# EAGLE design game_board_v02 (EAGLE 6.1)
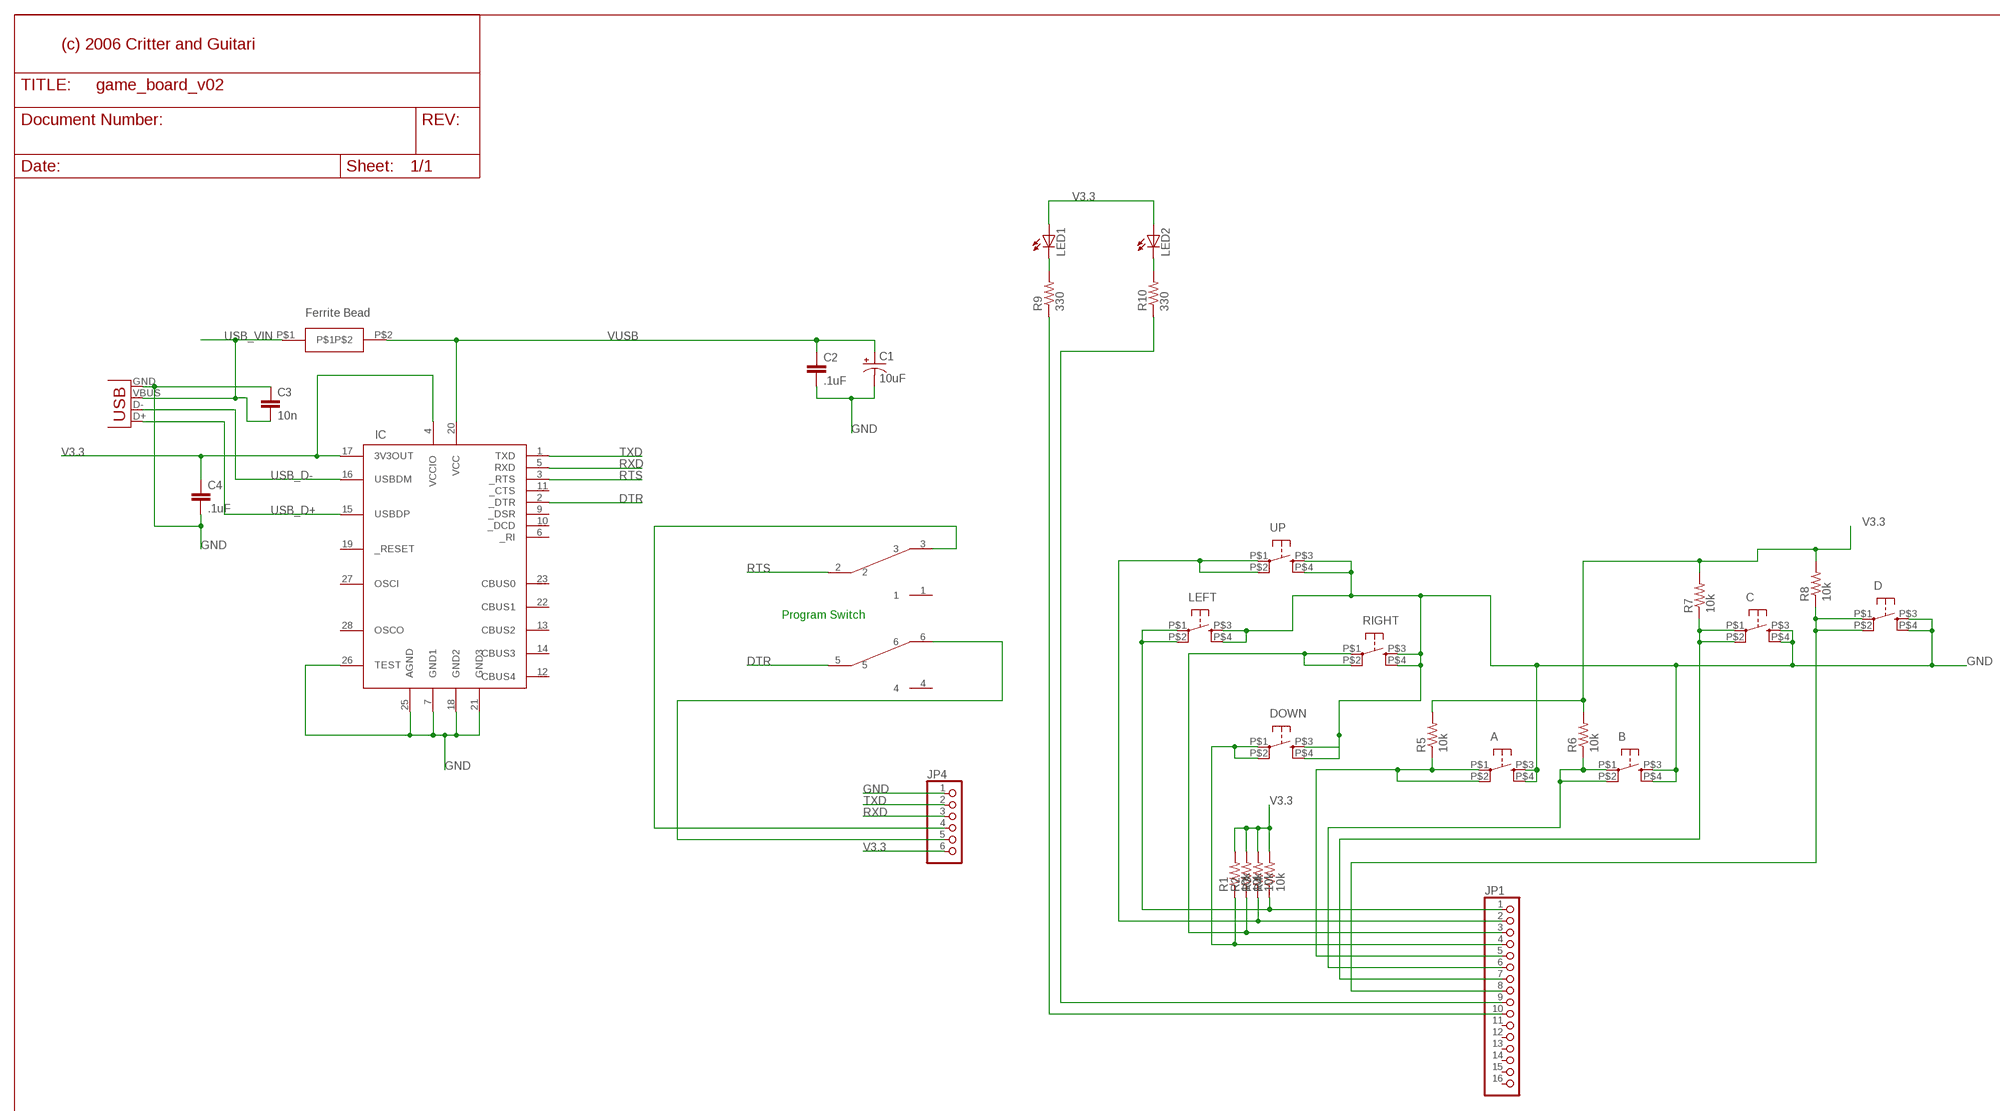
[diagram p0: schematic, sheet 1]

## Parts
A  TAC_SWITCHKSA_SEALED_TAC_SWITCH  [KSA_SEALED_TAC_SWITCH]
B  TAC_SWITCHKSA_SEALED_TAC_SWITCH  [KSA_SEALED_TAC_SWITCH]
C  TAC_SWITCHKSA_SEALED_TAC_SWITCH  [KSA_SEALED_TAC_SWITCH]
C1  10uF  CAP_POL1206  [CPOL_1206]
C2  .1uF  CAP0603  [C0603]
C3  10n  CAP0603  [C0603]
C4  .1uF  CAP0603  [C0603]
D  TAC_SWITCHKSA_SEALED_TAC_SWITCH  [KSA_SEALED_TAC_SWITCH]
DOWN  TAC_SWITCHKSA_SEALED_TAC_SWITCH  [KSA_SEALED_TAC_SWITCH]
IC  FT232RL  [SSOP28DB]
JP1  PINHD-1X16  [1X16]
JP4  PINHD-1X6  [1X06]
LED1  LED1206  [CHIPLED_1206]
LED2  LED1206  [CHIPLED_1206]
LEFT  TAC_SWITCHKSA_SEALED_TAC_SWITCH  [KSA_SEALED_TAC_SWITCH]
R1  10k  RES0603  [R0603]
R2  10k  RES0603  [R0603]
R3  10k  RES0603  [R0603]
R4  10k  RES0603  [R0603]
R5  10k  RES0603  [R0603]
R6  10k  RES0603  [R0603]
R7  10k  RES0603  [R0603]
R8  10k  RES0603  [R0603]
R9  330  RES0603  [R0603]
R10  330  RES0603  [R0603]
RIGHT  TAC_SWITCHKSA_SEALED_TAC_SWITCH  [KSA_SEALED_TAC_SWITCH]
U$1  FERRITE_BEAD  [FERRITE_BEAD]
U$2  SWITCH_DPDT  [SWITCH_DPDT_SMT]
UP  TAC_SWITCHKSA_SEALED_TAC_SWITCH  [KSA_SEALED_TAC_SWITCH]
X2  USB-B-H  [USB-B-H]

## Nets
DTR: IC.2(_DTR) U$2.5
GND [power]: A.P$3(S) A.P$4(S1) B.P$3(S) B.P$4(S1) C1.C(-) C2.2 C3.1 C4.2 C.P$3(S) C.P$4(S1) D.P$3(S) D.P$4(S1) DOWN.P$3(S) DOWN.P$4(S1) IC.7(GND1) IC.18(GND2) IC.21(GND3) IC.25(AGND) IC.26(TEST) JP4.1 LEFT.P$3(S) LEFT.P$4(S1) RIGHT.P$3(S) RIGHT.P$4(S1) UP.P$3(S) UP.P$4(S1) X2.GND
N$1: JP4.4 U$2.3
N$2: JP4.5 U$2.6
N$3: JP1.1 LEFT.P$1(P) LEFT.P$2(P1) R4.1
N$4: JP1.2 R3.1 UP.P$1(P) UP.P$2(P1)
N$5: JP1.3 R2.1 RIGHT.P$1(P) RIGHT.P$2(P1)
N$6: DOWN.P$1(P) DOWN.P$2(P1) JP1.4 R1.1
N$7: A.P$1(P) A.P$2(P1) JP1.5 R5.1
N$8: B.P$1(P) B.P$2(P1) JP1.6 R6.1
N$9: C.P$1(P) C.P$2(P1) JP1.7 R7.1
N$10: D.P$1(P) D.P$2(P1) JP1.8 R8.1
N$11: LED1.C R9.2
N$12: LED2.C R10.2
N$13: JP1.10 R9.1
N$14: JP1.9 R10.1
RTS: IC.3(_RTS) U$2.2
RXD: IC.5(RXD) JP4.3
TXD: IC.1(TXD) JP4.2
USB_D+: IC.15(USBDP) X2.D+
USB_D-: IC.16(USBDM) X2.D-
USB_VIN [power]: C3.2 U$1.P$1 X2.VBUS
V3.3 [power]: C4.1 IC.4(VCCIO) IC.17(3V3OUT) JP4.6 LED1.A LED2.A R1.2 R2.2 R3.2 R4.2 R5.2 R6.2 R7.2 R8.2
VUSB [power]: C1.A(+) C2.1 IC.20(VCC) U$1.P$2
Unconnected: IC.6(_RI) IC.9(_DSR) IC.10(_DCD) IC.11(_CTS) IC.12(CBUS4) IC.13(CBUS2) IC.14(CBUS3) IC.19(_RESET) IC.22(CBUS1) IC.23(CBUS0) IC.27(OSCI) IC.28(OSCO) JP1.11 JP1.12 JP1.13 JP1.14 JP1.15 JP1.16 U$2.1 U$2.4

## Notes on the sheet
- (c) 2006 Critter and Guitari
- Ferrite Bead
- Program Switch

## Library data of the parts
A B C D DOWN LEFT RIGHT UP = SparkFun:TAC_SWITCH: OMRON SWITCH
C1 = SparkFun:CAP_POL
C2-C4 = SparkFun:CAP: CAPACITOR
IC = ftdichip:FT232RL: USB UART 4th Generation USB UART (USB <-> Serial) Controller
JP1 = pinhead:PINHD-1X16: PIN HEADER
JP4 = pinhead:PINHD-1X6: PIN HEADER
LED1 LED2 = SparkFun:LED
R1-R10 = SparkFun:RES: RESISTOR
U$1 = SparkFun:FERRITE_BEAD
U$2 = SparkFun:SWITCH_DPDT
X2 = con-usb:USB: USB Connectors

## Net classes
0 default: width 0.254 mm
1 power: width 0.305 mm

## Board
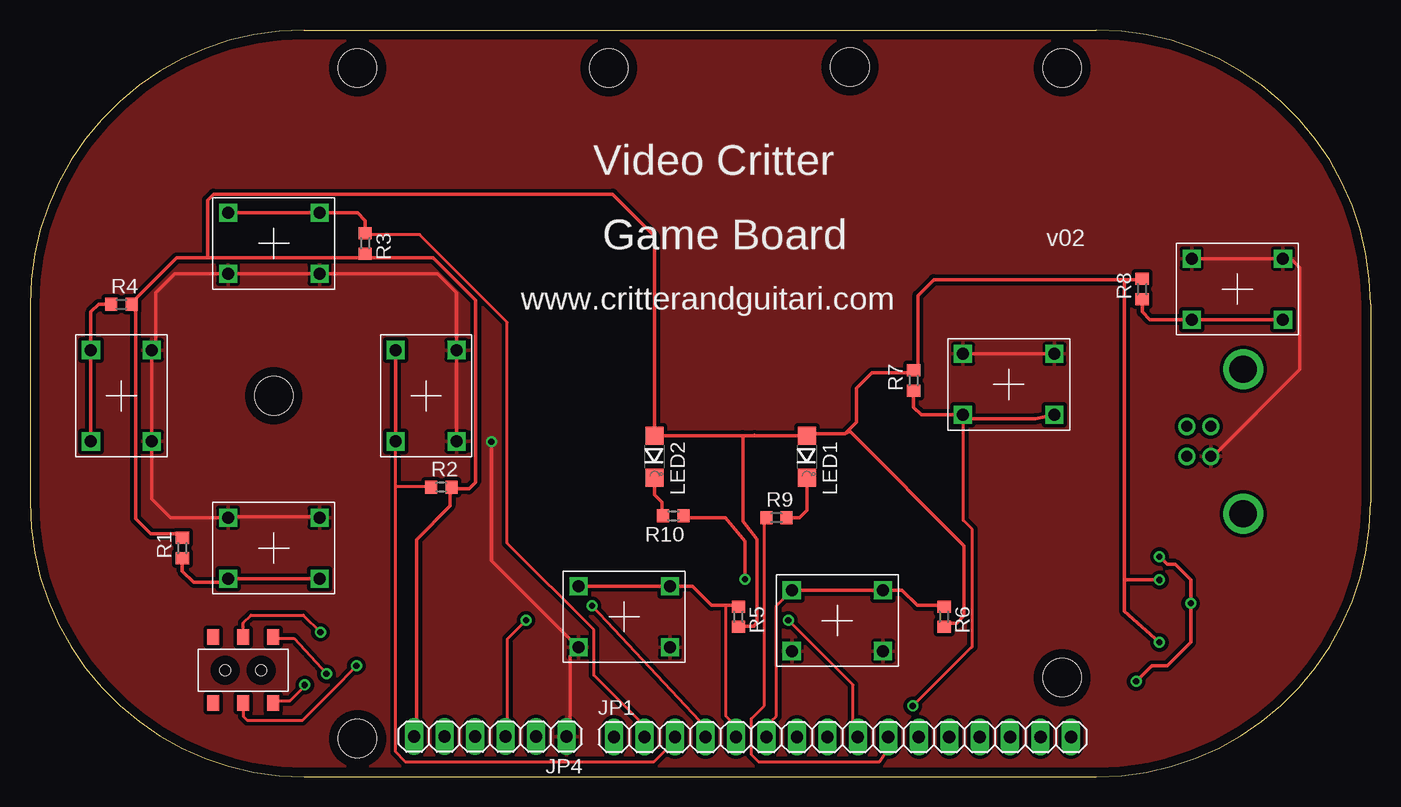
[diagram p1: board, top side]
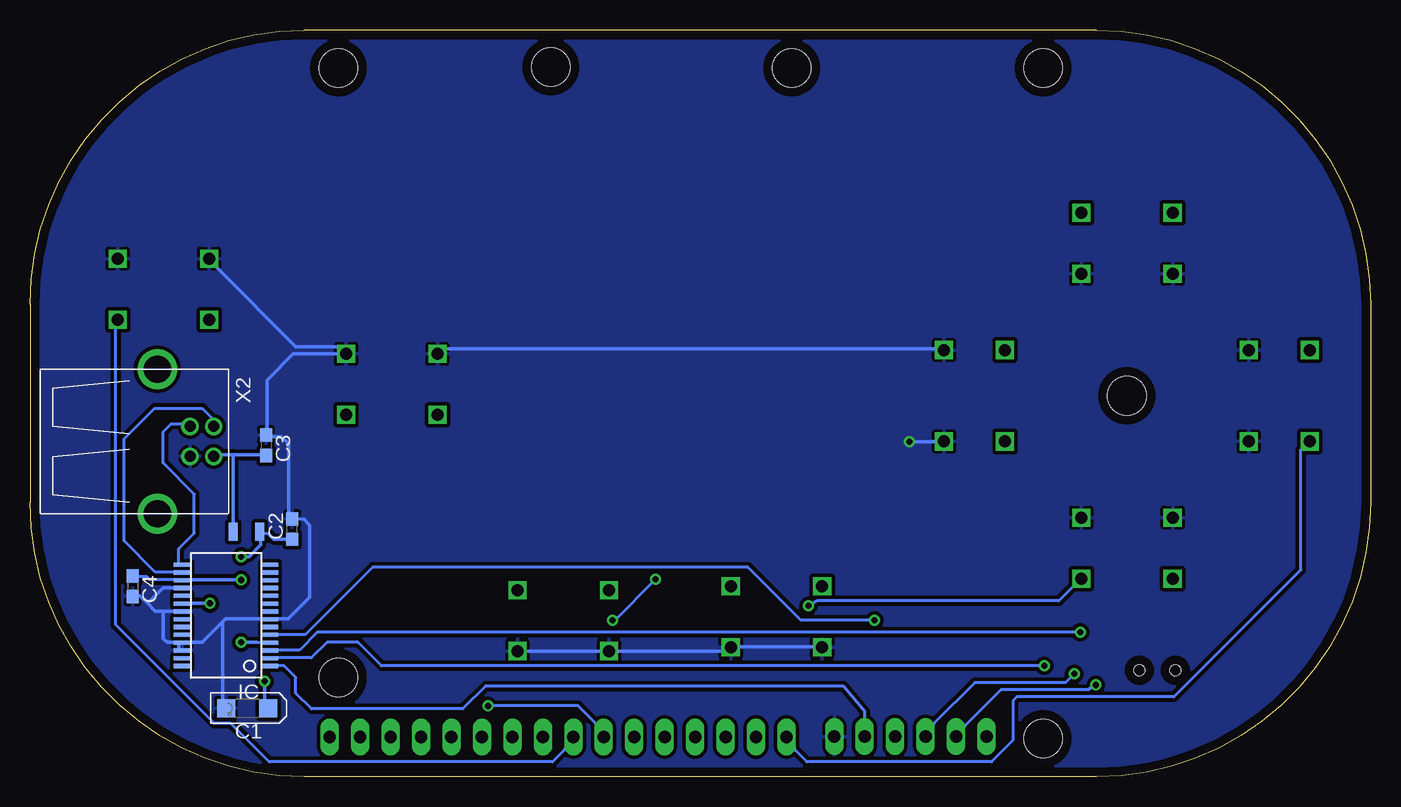
[diagram p2: board, bottom side, seen from below]

Size 111.76 x 62.23 mm. Coordinates in mm from the lower left corner, seen from the top.
Outline: 22.86,62.23 arc90 0,39.37 0,22.86 arc90 22.86,0 88.9,0 arc90 111.76,22.86 111.76,39.37 arc90 88.9,62.23 22.86,62.23
Copper layers (1*16): Top 0.035mm / dielectric 1.5mm / Bottom 0.035mm
Design rules: minimum track width 10mil, minimum drill 20mil, track to track 10mil, track to pad 10mil, pad to pad 10mil, via to via 10mil, smd to smd 10mil, copper to edge 30mil, drill to drill 8mil, minimum pad ring 10mil, minimum via ring 8mil, stop-mask expansion 4mil, vias tented up to drill 0mil, thermal gap 10mil
Holes 3.2 mm at 86.04,59.05 48.26,59.05 68.35,59.16 27.3,59.05 27.3,3.18 86.04,8.26 20.32,31.75

### Footprints (pad centres in the part's own frame; a part is rotated, then mirrored left to right if it is on the bottom)
KSA_SEALED_TAC_SWITCH = drill 1 square: P$1 -3.81,2.54; P$2 3.81,2.54; P$3 -3.81,-2.54; P$4 3.81,-2.54
CPOL_1206 = smd 1.5 x 1.5: A 0,-1.75; C 0,1.75
C0603 = smd 1.1 x 1: 1 -0.85,0; 2 0.85,0
SSOP28DB = smd 0.348 x 1.397: 1 -4.225,-3.656; 2 -3.575,-3.656; 3 -2.925,-3.656; 4 -2.275,-3.656; 5 -1.625,-3.656; 6 -0.975,-3.656; 7 -0.325,-3.656; 8 0.325,-3.656; 9 0.975,-3.656; 10 1.625,-3.656; 11 2.275,-3.656; 12 2.925,-3.656; 13 3.575,-3.656; 14 4.225,-3.656; 15 4.225,3.656; 16 3.575,3.656; 17 2.925,3.656; 18 2.275,3.656; 19 1.625,3.656; 20 0.975,3.656; 21 0.325,3.656; 22 -0.325,3.656; 23 -0.975,3.656; 24 -1.625,3.656; 25 -2.275,3.656; 26 -2.925,3.656; 27 -3.575,3.656; 28 -4.225,3.656
1X16 = drill 1.016 long: 1 -19.05,0; 2 -16.51,0; 3 -13.97,0; 4 -11.43,0; 5 -8.89,0; 6 -6.35,0; 7 -3.81,0; 8 -1.27,0; 9 1.27,0; 10 3.81,0; 11 6.35,0; 12 8.89,0; 13 11.43,0; 14 13.97,0; 15 16.51,0; 16 19.05,0
1X06 = drill 1.016 long: 1 -6.35,0; 2 -3.81,0; 3 -1.27,0; 4 1.27,0; 5 3.81,0; 6 6.35,0
CHIPLED_1206 = smd 1.5 x 1.5: A 0,-1.75; C 0,1.75
R0603 = smd 1 x 1.1: 1 -0.85,0; 2 0.85,0
FERRITE_BEAD = smd 0.75 x 1.5: P$1 -1.1,0; P$2 1.1,0
SWITCH_DPDT_SMT = smd 1 x 1.3: 1 -2.5,2.75; 2 0,2.75; 3 2.5,2.75; 4 -2.5,-2.75; 5 0,-2.75; 6 2.5,-2.75 | hole 0.9: -1.5,0; 1.5,0
USB-B-H = drill 0.914: D+ 0,1.25; D- 1.981,1.25; GND 0,-1.25; VBUS 1.981,-1.25 | drill 2.286: P$1 -2.718,-6.02; P$2 -2.718,6.02

### Placement (x,y rotation side)
A  49.53,13.33 0 top
B  67.31,13.02 0 top
C  81.6,32.7 180 top
C1  93.66,5.71 90 bottom
C2  89.89,20.64 90 bottom
C3  92.08,27.62 270 bottom
C4  103.2,15.88 270 bottom
D  100.65,40.64 180 top
DOWN  20.32,19.05 180 top
IC  95.41,13.45 90 bottom
JP1  67.74,3.31 0 top
JP4  38.37,3.35 180 top
LED1  64.77,26.67 180 top
LED2  52.07,26.67 180 top
LEFT  7.62,31.75 90 top
R1  12.7,19.05 90 top
R2  34.29,24.13 0 top
R3  27.94,44.45 270 top
R4  7.62,39.37 0 top
R5  59.05,13.33 270 top
R6  76.2,13.33 270 top
R7  73.66,33.02 90 top
R8  92.71,40.64 90 top
R9  62.23,21.59 0 top
R10  53.64,21.74 180 top
RIGHT  33.02,31.75 90 top
U$1  93.73,20.44 0 bottom
U$2  17.78,8.89 0 top
UP  20.32,44.45 0 top
X2  98.42,27.94 0 bottom

### Tracks (layer width: path | path; a pad name or v marks a point on that pad's centre or on a via)
DTR  (via drill 0.51)
  Top 0.254: v27.21,9.25 25.26,7.24 22.72,4.7 18.11,4.7 17.79,5.03 17.79,6 U$2.5
  Bottom 0.254: v27.21,9.25 82.46,9.25 84.41,11.2 87.01,11.2 88.31,9.9 91.56,9.9 IC.2
GND  (via drill 0.51)
  Top 0.305: RIGHT.P$3 RIGHT.P$4 35.56,40.32 33.97,41.91 UP.P$4 UP.P$3 12.07,41.91 10.48,40.32 10.48,35.88 LEFT.P$4 LEFT.P$3 10.16,23.18 11.75,21.59 DOWN.P$4 17.21,21.65 23.41,21.65 DOWN.P$3 | C.P$4 C.P$3 | D.P$4 D.P$3 105.21,43.05 105.86,42.4 105.86,33.95 98.71,26.8 X2.GND | JP4.1 45.01,4.85 45.01,10.05 A.P$3 45.01,11.45 38.46,18 v38.46,27.92
  Bottom 0.254: C3.1 92.11,28.45 | C3.1 | 92.01,28.55 C3.1
  Bottom 0.305: B.P$4 70.41,10.45 64.21,10.45 B.P$3 62.81,10.45 54.01,10.45 A.P$4 52.61,10.85 46.41,10.85 A.P$3 | 92.41,28.15 C3.1 91.71,28.35 90.83,28.35 90.21,27.73 90.21,21.85 C2.2 88.91,21.45 88.46,20.95 88.46,14.95 90.26,13.15 91.56,13.15 IC.7 92.21,13.15 95.46,13.15 95.71,12.9 | RIGHT.P$4 36.21,35.65 77.21,35.65 C.P$4 | D.P$4 96.21,42.45 89.61,35.85 86.01,35.85 C.P$3 89.82,35.24 92.01,33.05 92.01,28.55 | v38.46,27.92 35.56,27.9 RIGHT.P$3 | 99.36,11.2 99.36,10.55 IC.26 | 100.66,13.8 99.36,13.8 IC.21 | 100.66,13.8 101.31,13.8 101.96,14.45 | 101.96,14.45 102.61,15.1 C4.2 | 101.96,14.45 100.66,15.75 99.36,15.75 IC.18 | 95.71,12.9 97.41,11.2 98.71,11.2 IC.25 99.36,11.2 | 95.71,12.9 95.71,6 C1.C | 99.36,11.2 100.34,11.2 100.66,11.52 100.66,13.8
  pour Top (isolate 0.305): -3.81,67.31 115.57,67.31 115.57,-3.81 -3.81,-3.81
  pour Bottom (isolate 0.305): -1.27,64.77 113.03,64.77 113.03,-1.27 -1.27,-1.27
N$1  (via drill 0.51)
  Top 0.254: v24.71,8.58 22.01,11.53 20.16,11.53 | 20.16,11.53 20.06,11.53 | U$2.3 20.16,11.53
  Bottom 0.254: v24.71,8.58 25.43,7.85 33.01,7.85 36.41,4.45 JP4.4
N$2  (via drill 0.51)
  Top 0.254: v22.91,7.65 22.91,7.55 21.68,6.33 20.61,6.33 U$2.6
  Bottom 0.254: v22.91,7.65 23.56,7.25 30.81,7.25 33.81,4.25 JP4.5
N$3
  Top 0.305: LEFT.P$1 LEFT.P$2 4.76,35.56 5.08,35.88 5.08,38.73 5.71,39.37 R4.1
  Bottom 0.254: JP1.1 48.01,2.25 47.01,1.25 31.61,1.25 29.81,3.05 29.81,6.33 29.49,6.65 16.41,6.65 5.81,17.25 5.81,27.25 LEFT.P$1
N$4
  Top 0.254: JP1.2 50.81,4.65 47.01,8.45 47.01,12.25 39.79,19.48 39.79,37.88 32.48,45.17 28.41,45.17 R3.1
  Top 0.305: UP.P$1 UP.P$2 27.3,46.99 27.94,46.35 R3.1
N$5
  Top 0.254: JP1.3 53.01,2.25 52.01,1.25 31.29,1.25 30.46,2.1 30.46,24.2 | RIGHT.P$1 30.46,27.92 30.46,24.2 | R2.1 33.37,24.2 30.46,24.2
  Top 0.305: RIGHT.P$1 RIGHT.P$2
N$6  (via drill 0.51)
  Top 0.254: v46.86,14.25 55.81,4.65 JP1.4
  Top 0.305: DOWN.P$1 DOWN.P$2 16.19,16.19 13.65,16.19 12.7,17.15 R1.1
  Bottom 0.254: v46.86,14.25 46.14,14.65 26.01,14.65 24.81,15.85 DOWN.P$1
N$7
  Top 0.254: JP1.5 58.41,4.65 58.01,5.05 58.01,14.29
  Top 0.305: A.P$1 A.P$2 55.25,15.88 56.83,14.29 58.01,14.29 59.05,14.29 R5.1
N$8
  Top 0.254: JP1.6 61.81,4.65 62.21,5.05 62.21,14.25 62.81,14.85 B.P$1
  Top 0.305: B.P$1 B.P$2 72.71,15.56 73.98,14.29 76.2,14.29 R6.1
N$9  (via drill 0.51)
  Top 0.254: v73.59,5.9 78.46,10.78 arc60 78.56,10.88 78.56,20.62 77.81,21.38 77.81,29.77 C.P$2
  Top 0.305: C.P$1 83.82,29.84 77.47,29.84 C.P$2 74.3,30.16 73.66,30.8 R7.1
  Bottom 0.254: v73.59,5.9 66.06,5.9 64.61,4.45 JP1.7
N$10
  Top 0.305: 104.78,38.1 D.P$1 D.P$2 93.34,38.1 92.71,38.73 R8.1
  Bottom 0.254: JP1.8 67.21,2.25 68.21,1.25 91.81,1.25 95.01,4.45 96.41,4.45 104.61,12.65 104.61,37.45 D.P$1
N$11
  Top 0.305: LED1.C 64.77,22.23 64.14,21.59 R9.2
N$12
  Top 0.305: LED2.C 52.07,23.49 52.71,22.86 52.71,21.91 52.79,21.82 R10.2
N$13
  Top 0.254: R9.1 61.21,21.05 61.21,5.93 60.13,4.85 60.13,1.85 60.73,1.25 70.81,1.25 71.46,2.25 JP1.10
N$14  (via drill 0.51)
  Top 0.254: v63.21,13.05 68.61,7.65 68.61,4.65 JP1.9
  Top 0.305: R10.1 54.49,21.62 54.51,21.6 57.96,21.6 59.61,19.62 v59.61,16.45
  Bottom 0.254: v59.61,16.45 63.01,13.05 v63.21,13.05
RTS  (via drill 0.51)
  Top 0.254: v24.21,12.05 22.79,13.47 18.43,13.47 17.79,12.83 17.79,12.47 17.88,11.72 U$2.2
  Bottom 0.254: v24.21,12.05 87.81,12.05 89.28,10.55 91.56,10.55 IC.3 91.21,10.45
RXD  (via drill 0.51)
  Top 0.254: v41.36,13.05 39.81,11.5 39.81,4.85 JP4.3
  Bottom 0.254: v41.36,13.05 47.51,13.05 51.91,17.45 83.21,17.45 88.81,11.85 91.56,11.85 IC.5 91.21,11.85
TXD
  Bottom 0.254: 91.21,9.25 IC.1 91.56,9.25 | JP4.2 42.16,5.43 43.96,7.55 73.78,7.55 75.69,5.65 88.28,5.65 89.61,6.97 89.61,8.28 90.59,9.25 91.21,9.25 | 91.21,9.25 91.23,9.25
USB_D+
  Bottom 0.254: 99.01,17.65 IC.15 99.36,17.7 99.36,19 98.06,20.3 98.06,23.55 100.66,26.15 100.66,28.75 100.01,29.4 98.71,29.4 X2.D+
USB_D-
  Bottom 0.254: IC.16 99.36,17.05 101.31,17.05 103.91,19.65 103.91,28.16 101.37,30.7 97.41,30.7 96.11,29.4 X2.D-
USB_VIN
  Bottom 0.305: 94.81,26.85 95.81,26.85 X2.VBUS | 94.81,26.85 92.41,26.85 C3.2 | 94.81,26.85 94.81,21.05 U$1.P$1
V3.3  (via drill 0.51)
  Top 0.254: R2.2 35.14,24.01 arc-90 35.01,23.88 arc-90 35.13,24
  Top 0.305: 64.93,28.42 LED1.A | 59.44,28.42 LED2.A 52.06,29.05 52.06,45.06 48.57,48.55 15.31,48.55 14.81,48.05 14.81,43.25 | 59.44,28.42 64.93,28.42 | 64.93,28.42 65.09,28.57 67.95,28.57 | 67.95,28.57 68.9,29.53 68.9,32.38 70.17,33.66 73.34,33.66 73.66,33.97 R7.2 74.01,33.95 74.01,40.1 75.34,41.42 91.23,41.42 | R2.2 35.13,23.98 35.01,23.45 35.01,22.58 32.21,19.75 32.21,4.85 JP4.6 | 14.81,43.25 27.41,43.25 R3.2 28.41,43.25 33.61,43.25 37.14,39.73 37.14,24.55 36.59,24 35.13,24 | 14.81,43.25 12.21,43.25 8.81,39.85 R4.2 8.81,38.85 8.81,21.52 10.08,20.25 12.21,20.25 R1.2 | 59.44,28.42 59.44,21.3 60.61,19.8 60.61,12.9 60.36,12.55 59.41,12.55 R5.2 | 59.44,28.42 60.41,28.45 | R6.2 76.6,12.78 77.27,12.78 77.86,13.43 77.86,19.25 68.34,28.77 67.95,28.57 | 91.23,41.42 92.21,41.42 R8.2 | v94.16,11.2 91.23,13.8 91.23,16.4 | 91.23,41.42 91.23,16.4 | 91.23,16.4 v94.16,16.4
  Bottom 0.254: 99.36,16.4 101.76,16.4 102.01,16.65 103.11,16.65 103.2,16.74 | 103.2,16.74 103.21,16.75 | 103.2,16.74 C4.1
  Bottom 0.305: 99.36,16.4 IC.17 98.71,16.4 v94.16,16.4 | v94.16,11.2 92.86,11.2 IC.4
VUSB  (via drill 0.51)
  Top 0.305: v94.16,18.35 94.81,17.7 95.46,17.7 96.76,16.4 v96.76,14.45 96.76,11.2 94.81,9.25 93.51,9.25 v92.21,7.95
  Bottom 0.305: 92.53,20.3 92.86,20.3 U$1.P$2 | 92.53,20.3 91.91,20.25 91.46,19.8 91.26,19.8 C2.1 | v96.76,14.45 98.71,14.45 IC.20 | v94.16,18.35 93.51,18.35 92.53,19.33 92.53,20.3 | v92.21,7.95 92.21,6 C1.A

### Text on the board
tPlace: Video Critter | v02 | Game Board | www.critterandguitari.com